# Altium schematic sheet DB_ECG-X01.SchDoc: ECG
size Letter; Organization: GEORGIA TECH; Address1: NORTH AVE NW; Address2: ATLANTA, GA, 30332; DocumentNumber: P001; Revision: X01; SheetNumber: 4; SheetTotal: 4
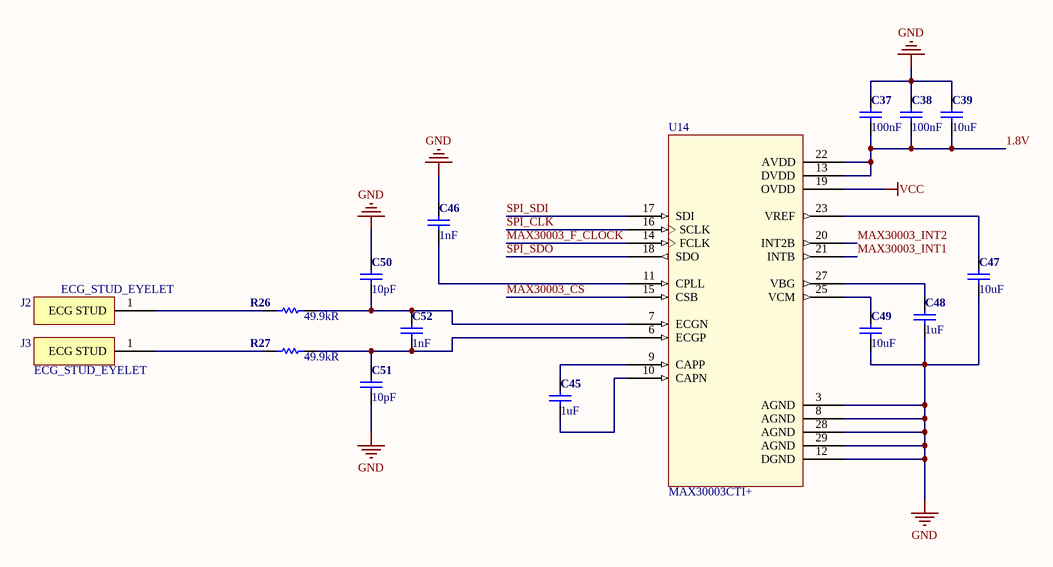
[diagram p0: DB_ECG-X01.SchDoc]

## Parts
C37  100nF  [C0603]
C38  100nF  [C0603]
C39  10uF  [C0603]
C45  1uF  [C0402]
C46  1nF  [C0402]
C47  10uF  [C0603]
C48  1uF  [C0402]
C49  10uF  [C0603]
C50  10pF  [C0402]
C51  10pF  [C0402]
C52  1nF  [C0402]
J2  ECG_STUD_EYELET  [ECG_STUD]
J3  ECG_STUD_EYELET  [ECG_STUD]
R26  49.9kR  [R0402]
R27  49.9kR  [R0402]
U14  MAX30003CTI+  [QFN50P500X500X80-29N]

## Nets
GND: C37.2 C38.2 C39.2 C46.1 C47.1 C48.2 C49.1 C50.1 C51.2 U14.3(AGND) U14.8(AGND) U14.12(DGND) U14.28(AGND) U14.29(AGND)
VCC: U14.19(OVDD)
1.8V: C37.1 C38.1 C39.1 U14.13(DVDD) U14.22(AVDD)
MAX30003_CS: U14.15(CSB)
MAX30003_F_CLOCK: U14.14(FCLK)
MAX30003_INT1: U14.21(INTB)
MAX30003_INT2: U14.20(INT2B)
SPI_CLK: U14.16(SCLK)
SPI_SDI: U14.17(SDI)
SPI_SDO: U14.18(SDO)
NetC45_1: C45.1 U14.9(CAPP)
NetC45_2: C45.2 U14.10(CAPN)
NetC46_2: C46.2 U14.11(CPLL)
NetC47_2: C47.2 U14.23(VREF)
NetC48_1: C48.1 U14.27(VBG)
NetC49_2: C49.2 U14.25(VCM)
NetC50_2: C50.2 C52.1 R26.2 U14.7(ECGN)
NetC51_1: C51.1 C52.2 R27.2 U14.6(ECGP)
NetJ2_1: J2.1(ECG_STUD) R26.1
NetJ3_1: J3.1(ECG_STUD) R27.1

## Notes on the sheet
- Title
- Size:
- Date:
- Letter
- Number:
- Time:
- Revision:
- Sheet
- of
- File:

## Library data of the parts
C37 C38 = C-0603(1608): Ceramic Capacitor, Multilayer, Ceramic, 25V, 80% +Tol, 20% -Tol, Y5V, -82/+22% TC, 0.1uF, Surface Mount, 0402; Manufacturer: Yageo; Manufacturer Part Number: CC0402ZRY5V8BB104; Dissipation Factor: 12.5%; Insulation Resistance: 10GR; ComponentLink1URL: https://datasheet.ciiva.com/169/product-169683.pdf; ComponentLink1Description: https://datasheet.ciiva.com/169/product-169683.pdf; Supplier 1: Digi-Key; Supplier Part Number 1: 311-1375-1-ND; RoHS: Yes; Category: Ceramic Capacitors; Stock 1: 3200380; Pricing 1: 1=0.10000, 10=0.03200, 100=0.01440, 500=0.01028, 1000=0.00808, 2500=0.00734, 5000=0.00676 (USD); Mount: Surface Mount; Case/Package: 0402; Number of Pins: 2; Weight: 2.3E-05oz; Case Code (Metric): 1005; Case Code (Imperial): 0402; Min Operating Temperature: -30°C; Max Operating Temperature: 85°C; Packaging: Tape and Reel; Capacitance: 100nF; Tolerance: 80%; Voltage Rating: 25V; Voltage Rating (DC): 25V; Package Quantity: 1; Dielectric: Y5V; Termination: SMD/SMT; Composition: Ceramic; Length: 1mm; Height: 0.5mm; Width: 0.02inch; Thickness: 0.022inch; Depth: 0.5mm; Radiation Hardening: No; REACH SVHC: Unknown; Lead Free: Lead Free; Halogen Free: Halogen Free; ComponentLink2URL: https://datasheet.ciiva.com:443/pdfs/VipMasterIC/IC/YAGO/YAGO-S-A0004841839/YAGO-S-A0004841839-1.pdf?src-supplier=IHS+Markit; ComponentLink2Description: https://datasheet.ciiva.com:443/pdfs/VipMasterIC/IC/YAGO/YAGO-S-A0004841839/YAGO-S-A0004841839-1.pdf?src-supplier=IHS+Markit; ComponentLink3URL: https://datasheet.ciiva.com/144/mlccorderingcode-144022.pdf?src-supplier=Digi-Key; ComponentLink3Description: https://datasheet.ciiva.com/144/mlccorderingcode-144022.pdf?src-supplier=Digi-Key; ComponentLink4URL: https://datasheet.ciiva.com/144/mlccorderingcode-144023.pdf?src-supplier=Digi-Key; ComponentLink4Description: https://datasheet.ciiva.com/144/mlccorderingcode-144023.pdf?src-supplier=Digi-Key; ComponentLink5URL: https://datasheet.ciiva.com/144/mlccorderingcode-144024.pdf?src-supplier=Digi-Key; ComponentLink5Description: https://datasheet.ciiva.com/144/mlccorderingcode-144024.pdf?src-supplier=Digi-Key; ComponentLink6URL: https://datasheet.ciiva.com/7978/1132289-7978124.pdf?src-supplier=Element14; ComponentLink6Description: https://datasheet.ciiva.com/7978/1132289-7978124.pdf?src-supplier=Element14; ComponentLink7URL: https://datasheet.ciiva.com/11586/upy-gphc-y5v-6-3v-to-50v-5-11586526.pdf?src-supplier=Avnet; ComponentLink7Description: https://datasheet.ciiva.com/11586/upy-gphc-y5v-6-3v-to-50v-5-11586526.pdf?src-supplier=Avnet; ComponentLink8URL: https://datasheet.ciiva.com/17437/upy-gphc-y5v-6-3v-to-50v-5-17437230.pdf?src-supplier=Avnet+Europe; ComponentLink8Description: https://datasheet.ciiva.com/17437/upy-gphc-y5v-6-3v-to-50v-5-17437230.pdf?src-supplier=Avnet+Europe
C39 C47 C49 = C-0603(1608): Ceramic Capacitor, Multilayer, Ceramic, 25V, 20% +Tol, 20% -Tol, X5R, 15% TC, 10uF, Surface Mount, 0603; Manufacturer: Murata; Manufacturer Part Number: GRM188R61E106MA73J; ComponentLink1URL: https://datasheet.ciiva.com/169/product-169683.pdf; ComponentLink1Description: https://datasheet.ciiva.com/169/product-169683.pdf; Supplier 1: Digi-Key; Supplier Part Number 1: 490-12737-1-ND; RoHS: Yes; Category: Ceramic Capacitors; Stock 1: 57394; Pricing 1: 1=0.46000, 10=0.32200, 100=0.19320, 500=0.14488, 1000=0.12235, 2500=0.11591, 5000=0.10947 (USD); Mount: Surface Mount; Case/Package: 0603; Weight: 0.000222oz; Case Code (Imperial): 0603; Case Code (Metric): 1608; Min Operating Temperature: -55°C; Max Operating Temperature: 85°C; Tolerance: 20%; Packaging: Tape and Reel; Capacitance: 10uF; Voltage Rating: 25V; Dielectric: X5R; Termination: SMD/SMT; Composition: Ceramic; Voltage Rating (DC): 25V; Package Quantity: 10000; Length: 0.063inch; Height: 0.8mm; Width: 0.031inch; Thickness: 0.039inch; ComponentLink2URL: https://datasheet.ciiva.com:443/pdfs/VipMasterIC/IC/MURE/MURE-S-A0004349797/MURE-S-A0004352800-1.pdf?src-supplier=IHS+Markit; ComponentLink2Description: https://datasheet.ciiva.com:443/pdfs/VipMasterIC/IC/MURE/MURE-S-A0004349797/MURE-S-A0004352800-1.pdf?src-supplier=IHS+Markit; ComponentLink3URL: http://www.mouser.com/ds/2/281/GRM188R61E106MA73-01-1064626.pdf?src-supplier=Mouser; ComponentLink3Description: http://www.mouser.com/ds/2/281/GRM188R61E106MA73-01-1064626.pdf?src-supplier=Mouser; ComponentLink4URL: https://search.murata.co.jp/Ceramy/image/img/A01X/G101/ENG/GRM188R61E106MA73-01.pdf?src-supplier=Digi-Key; ComponentLink4Description: https://search.murata.co.jp/Ceramy/image/img/A01X/G101/ENG/GRM188R61E106MA73-01.pdf?src-supplier=Digi-Key
C45 C48 = C-0402(1005): Ceramic Capacitor, Multilayer, Ceramic, 6.3V, 20% +Tol, 20% -Tol, X5R, 15% TC, 1uF, Surface Mount, 0402; Manufacturer: Yageo; Manufacturer Part Number: CC0402MRX5R5BB105; Dissipation Factor: 10%; ComponentLink1URL: https://datasheet.ciiva.com/169/product-169683.pdf; ComponentLink1Description: https://datasheet.ciiva.com/169/product-169683.pdf; Supplier 1: Digi-Key; Supplier Part Number 1: 311-1441-1-ND; RoHS: Yes; Category: Ceramic Capacitors; Stock 1: 16697; Pricing 1: 1=0.13000, 10=0.08900, 100=0.04200, 500=0.02946, 1000=0.02439, 2500=0.02270, 5000=0.02076 (USD); Mount: Surface Mount; Case/Package: 0402; Number of Pins: 2; Case Code (Imperial): 0402; Case Code (Metric): 1005; Min Operating Temperature: -55°C; Max Operating Temperature: 85°C; Capacitance: 1uF; Tolerance: 20%; Voltage Rating: 6.3V; Voltage Rating (DC): 6.3V; Packaging: Tape and Reel; Package Quantity: 1; Dielectric: X5R; Termination: SMD/SMT; Composition: Ceramic; Length: 1mm; Height: 0.5mm; Width: 0.5mm; Thickness: 0.022inch; Depth: 0.5mm; Lead Free: Lead Free; Halogen Free: Halogen Free; ComponentLink2URL: https://datasheet.ciiva.com:443/pdfs/VipMasterIC/IC/YAGO/YAGO-S-A0006851646/YAGO-S-A0006851646-1.pdf?src-supplier=IHS+Markit; ComponentLink2Description: https://datasheet.ciiva.com:443/pdfs/VipMasterIC/IC/YAGO/YAGO-S-A0006851646/YAGO-S-A0006851646-1.pdf?src-supplier=IHS+Markit; ComponentLink3URL: https://datasheet.ciiva.com/176/mlccorderingcode-176806.pdf?src-supplier=Digi-Key; ComponentLink3Description: https://datasheet.ciiva.com/176/mlccorderingcode-176806.pdf?src-supplier=Digi-Key; ComponentLink4URL: https://datasheet.ciiva.com/176/mlccorderingcode-176807.pdf?src-supplier=Digi-Key; ComponentLink4Description: https://datasheet.ciiva.com/176/mlccorderingcode-176807.pdf?src-supplier=Digi-Key; ComponentLink5URL: https://datasheet.ciiva.com/176/mlccorderingcode-176808.pdf?src-supplier=Digi-Key; ComponentLink5Description: https://datasheet.ciiva.com/176/mlccorderingcode-176808.pdf?src-supplier=Digi-Key
C46 C52 = C-0402(1005): Ceramic Capacitor, Multilayer, Ceramic, 10V, 5% +Tol, 5% -Tol, C0G, -/+30ppm/Cel TC, 0.001uF, 0402; Manufacturer: KEMET; Manufacturer Part Number: C0402C102J8GAC7867; ComponentLink1URL: https://datasheet.ciiva.com/169/product-169683.pdf; ComponentLink1Description: https://datasheet.ciiva.com/169/product-169683.pdf; Supplier 1: Digi-Key; Supplier Part Number 1: 399-14868-1-ND; RoHS: No; Category: Ceramic Capacitors; Stock 1: 20757; Pricing 1: 1=0.26000, 10=0.18100, 100=0.10240, 500=0.07226, 1000=0.06322, 2500=0.06022, 5000=0.05570 (USD); Mount: Surface Mount; Case/Package: 0402; Case Code (Imperial): 0402; Case Code (Metric): 1005; Min Operating Temperature: -55°C; Max Operating Temperature: 125°C; Packaging: Tape and Reel; Capacitance: 1nF; Tolerance: 5%; Voltage Rating: 10V; ComponentLink2URL: https://datasheet.ciiva.com:443/pdfs/VipMasterIC/IC/KEME/KEMES02331/KEMES02331-1.pdf?src-supplier=IHS+Markit; ComponentLink2Description: https://datasheet.ciiva.com:443/pdfs/VipMasterIC/IC/KEME/KEMES02331/KEMES02331-1.pdf?src-supplier=IHS+Markit; ComponentLink3URL: https://api.kemet.com/component-edge/download/datasheet/C0402C102J8GAC7867.pdf?src-supplier=Digi-Key; ComponentLink3Description: https://api.kemet.com/component-edge/download/datasheet/C0402C102J8GAC7867.pdf?src-supplier=Digi-Key
C50 C51 = C-0402(1005): Ceramic Capacitor, Multilayer, Ceramic, 50V, 5% +Tol, 5% -Tol, C0G, 30ppm/Cel TC, 0.00001uF, Surface Mount, 0402; Manufacturer: Murata; Manufacturer Part Number: GJM1555C1H100JB01D; ComponentLink1URL: https://datasheet.ciiva.com/169/product-169683.pdf; ComponentLink1Description: https://datasheet.ciiva.com/169/product-169683.pdf; Supplier 1: Digi-Key; Supplier Part Number 1: 490-3113-1-ND; RoHS: Yes; Category: Ceramic Capacitors; Stock 1: 1839463; Pricing 1: 1=0.29000, 10=0.19700, 100=0.10000, 500=0.06842, 1000=0.06052, 2500=0.05789, 5000=0.05262 (USD); Mount: Surface Mount; Case/Package: 0402; Case Code (Metric): 1005; Case Code (Imperial): 0402; Min Operating Temperature: -55°C; Max Operating Temperature: 125°C; Capacitance: 10pF; Tolerance: 5%; Packaging: Tape and Reel; Voltage Rating: 50V; Package Quantity: 1; Voltage Rating (DC): 50V; Dielectric: C0G; Termination: SMD/SMT; Voltage: 50V; Length: 1mm; Height: 0.5mm; Width: 0.02inch; Thickness: 0.022inch; Depth: 0.5mm; Radiation Hardening: No; Lead Free: Lead Free; ComponentLink2URL: https://datasheet.ciiva.com:443/pdfs/VipMasterIC/IC/MURE/MURE-S-A0004378008/MURE-S-A0004383508-1.pdf?src-supplier=IHS+Markit; ComponentLink2Description: https://datasheet.ciiva.com:443/pdfs/VipMasterIC/IC/MURE/MURE-S-A0004378008/MURE-S-A0004383508-1.pdf?src-supplier=IHS+Markit; ComponentLink3URL: https://datasheet.ciiva.com/18183/getdatasheetpartid-228488-18183804.pdf?src-supplier=Verical; ComponentLink3Description: https://datasheet.ciiva.com/18183/getdatasheetpartid-228488-18183804.pdf?src-supplier=Verical; ComponentLink4URL: https://datasheet.ciiva.com/29542/partnumbering-e-01-29542760.pdf?src-supplier=Digi-Key; ComponentLink4Description: https://datasheet.ciiva.com/29542/partnumbering-e-01-29542760.pdf?src-supplier=Digi-Key; ComponentLink5URL: https://datasheet.ciiva.com/29542/partnumbering-e-01-29542761.pdf?src-supplier=Digi-Key; ComponentLink5Description: https://datasheet.ciiva.com/29542/partnumbering-e-01-29542761.pdf?src-supplier=Digi-Key; ComponentLink6URL: https://datasheet.ciiva.com/165/partnumbering-e-01-165051.pdf?src-supplier=Digi-Key; ComponentLink6Description: https://datasheet.ciiva.com/165/partnumbering-e-01-165051.pdf?src-supplier=Digi-Key; ComponentLink7URL: https://datasheet.ciiva.com/11607/product-11607356.pdf?src-supplier=Avnet; ComponentLink7Description: https://datasheet.ciiva.com/11607/product-11607356.pdf?src-supplier=Avnet
J2 J3 = ECG_STUD_EYELET: 996 Stud/Eyelet combination, LUF: 3.25mm/6.25mm, O.D.: 10.25mm, https://www.romed.com/medical-electrical-snap-fasteners.aspx
R26 R27 = R-0402(1005): Fixed Resistor, Metal Glaze/thick Film, 0.0625W, 49900ohm, 50V, 1% +/-Tol, 100ppm/Cel, Surface Mount, 0402; Manufacturer: Yageo; Manufacturer Part Number: AC0402FR-0749K9L; Power Rating: 62.5mW; Temperature Coefficient: 100ppm/°C; Max Power Dissipation: 63mW; Supplier 1: Digi-Key; Supplier Part Number 1: YAG3493CT-ND; RoHS: Yes; Category: Chip SMD Resistors; Stock 1: 87188; Pricing 1: 1=0.10000, 10=0.02100, 100=0.00870, 1000=0.00390, 2500=0.00338, 5000=0.00279 (USD); Case/Package: 0402; Weight: 2.3E-05oz; Case Code (Imperial): 0402; Case Code (Metric): 1005; Min Operating Temperature: -55°C; Max Operating Temperature: 155°C; Voltage Rating: 50V; Resistance: 49.9kR; Tolerance: 1%; Packaging: Tape and Reel; Termination: SMD/SMT; Composition: Thick Film; Number of Terminations: 2; Features: Moisture Resistant,Automotive AEC-Q200; Length: 0.039inch; Height: 0.015inch; Width: 0.5mm; ComponentLink1URL: https://datasheet.ciiva.com:443/pdfs/VipMasterIC/IC/YAGO/YAGO-S-A0003597364/YAGO-S-A0003597364-1.pdf?src-supplier=IHS+Markit; ComponentLink1Description: https://datasheet.ciiva.com:443/pdfs/VipMasterIC/IC/YAGO/YAGO-S-A0003597364/YAGO-S-A0003597364-1.pdf?src-supplier=IHS+Markit; ComponentLink2URL: http://www.mouser.com/ds/2/447/yageodocoutput-1111992.pdf?src-supplier=Mouser; ComponentLink2Description: http://www.mouser.com/ds/2/447/yageodocoutput-1111992.pdf?src-supplier=Mouser; ComponentLink3URL: http://www.yageo.com/NewPortal/yageodocoutput?fileName=/pdf/R-Chip/PYu-AC_51_RoHS_L_6.pdf&src-supplier=Digi-Key; ComponentLink3Description: http://www.yageo.com/NewPortal/yageodocoutput?fileName=/pdf/R-Chip/PYu-AC_51_RoHS_L_6.pdf&src-supplier=Digi-Key
U14 = MAX30003CTI+: Analog Circuit, 1 Func, CMOS; Manufacturer: Maxim; Min Supply Voltage: 1.2V; Max Supply Voltage: 2V; Supplier 1: Digi-Key; Supplier Part Number 1: MAX30003CTI+-ND; RoHS: No; Category: RF Semiconductors and Devices; Stock 1: 286; Pricing 1: 1=8.21000, 10=7.41200, 25=7.06760, 100=5.86090, 250=5.34380, 500=4.99902, 1000=4.98888 (USD); Number of Pins: 28; Min Operating Temperature: 0°C; Max Operating Temperature: 70°C; REACH SVHC: No SVHC; ComponentLink1URL: https://datasheet.ciiva.com:443/pdfs/VipMasterIC/IC/MAXM/MAXM-S-A0009086108/MAXM-S-A0009086108-1.pdf?src-supplier=IHS+Markit; ComponentLink1Description: https://datasheet.ciiva.com:443/pdfs/VipMasterIC/IC/MAXM/MAXM-S-A0009086108/MAXM-S-A0009086108-1.pdf?src-supplier=IHS+Markit; ComponentLink2URL: http://www.farnell.com/datasheets/2159846.pdf?src-supplier=Farnell; ComponentLink2Description: http://www.farnell.com/datasheets/2159846.pdf?src-supplier=Farnell; ComponentLink3URL: https://pdfserv.maximintegrated.com/en/an/MAX-ECG-MONITOR-User-Guide.pdf?src-supplier=Digi-Key; ComponentLink3Description: https://pdfserv.maximintegrated.com/en/an/MAX-ECG-MONITOR-User-Guide.pdf?src-supplier=Digi-Key; ComponentLink4URL: http://www.farnell.com/datasheets/2159846.pdf?src-supplier=Element14; ComponentLink4Description: http://www.farnell.com/datasheets/2159846.pdf?src-supplier=Element14; Manufacturer Part Number: MAX30003CTI+